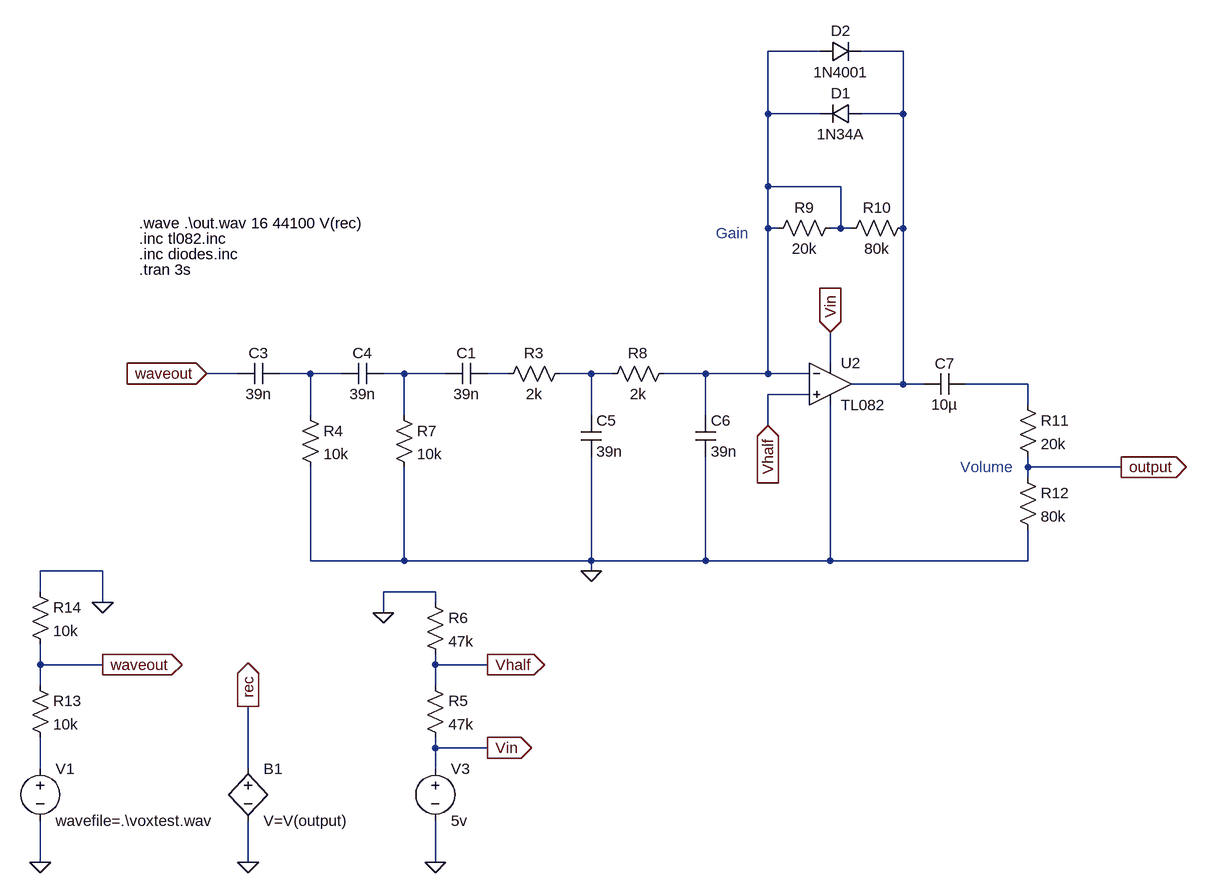
[diagram p0: schematic Telephoner2.asc]
Telephoner2.asc, the LTspice schematic file:
Version 4
SHEET 1 1324 692
WIRE -2720 -784 -2800 -784
WIRE -2592 -784 -2656 -784
WIRE -2800 -688 -2800 -784
WIRE -2720 -688 -2800 -688
WIRE -2592 -688 -2592 -784
WIRE -2592 -688 -2656 -688
WIRE -2800 -576 -2800 -688
WIRE -2688 -576 -2800 -576
WIRE -2800 -512 -2800 -576
WIRE -2784 -512 -2800 -512
WIRE -2688 -512 -2688 -576
WIRE -2688 -512 -2704 -512
WIRE -2672 -512 -2688 -512
WIRE -2592 -512 -2592 -688
WIRE -2704 -304 -2704 -352
WIRE -3616 -288 -3664 -288
WIRE -3504 -288 -3552 -288
WIRE -3456 -288 -3504 -288
WIRE -3360 -288 -3392 -288
WIRE -3296 -288 -3360 -288
WIRE -3200 -288 -3232 -288
WIRE -3072 -288 -3120 -288
WIRE -3040 -288 -3072 -288
WIRE -2896 -288 -2960 -288
WIRE -2800 -288 -2800 -512
WIRE -2800 -288 -2896 -288
WIRE -2736 -288 -2800 -288
WIRE -2592 -272 -2592 -512
WIRE -2592 -272 -2672 -272
WIRE -2560 -272 -2592 -272
WIRE -2400 -272 -2496 -272
WIRE -2736 -256 -2800 -256
WIRE -2400 -240 -2400 -272
WIRE -3504 -224 -3504 -288
WIRE -3360 -224 -3360 -288
WIRE -3072 -224 -3072 -288
WIRE -2896 -224 -2896 -288
WIRE -2800 -208 -2800 -256
WIRE -2400 -144 -2400 -160
WIRE -2256 -144 -2400 -144
WIRE -2400 -128 -2400 -144
WIRE -3504 0 -3504 -144
WIRE -3360 0 -3360 -144
WIRE -3360 0 -3504 0
WIRE -3072 0 -3072 -160
WIRE -3072 0 -3360 0
WIRE -2896 0 -2896 -160
WIRE -2896 0 -3072 0
WIRE -2704 0 -2704 -240
WIRE -2704 0 -2896 0
WIRE -2400 0 -2400 -48
WIRE -2400 0 -2704 0
WIRE -3824 16 -3920 16
WIRE -3072 16 -3072 0
WIRE -3920 48 -3920 16
WIRE -3312 48 -3392 48
WIRE -3824 64 -3824 16
WIRE -3312 64 -3312 48
WIRE -3392 80 -3392 48
WIRE -3920 160 -3920 128
WIRE -3824 160 -3920 160
WIRE -3312 160 -3312 144
WIRE -3232 160 -3312 160
WIRE -3920 192 -3920 160
WIRE -3312 192 -3312 160
WIRE -3312 288 -3312 272
WIRE -3232 288 -3312 288
WIRE -3920 320 -3920 272
WIRE -3600 320 -3600 224
WIRE -3312 320 -3312 288
WIRE -3920 464 -3920 400
WIRE -3600 464 -3600 400
WIRE -3312 464 -3312 400
FLAG -3920 464 0
FLAG -3824 160 waveout
IOPIN -3824 160 Out
FLAG -3664 -288 waveout
IOPIN -3664 -288 In
FLAG -3600 464 0
FLAG -3600 224 rec
IOPIN -3600 224 Out
FLAG -3312 464 0
FLAG -3232 288 Vin
IOPIN -3232 288 Out
FLAG -3392 80 0
FLAG -3232 160 Vhalf
IOPIN -3232 160 Out
FLAG -3072 16 0
FLAG -2800 -208 Vhalf
IOPIN -2800 -208 In
FLAG -2704 -352 Vin
IOPIN -2704 -352 In
FLAG -2256 -144 output
IOPIN -2256 -144 Out
FLAG -3824 64 0
SYMBOL voltage -3920 304 R0
SYMATTR InstName V1
SYMATTR Value wavefile=.\voxtest.wav
SYMBOL voltage -3312 304 R0
WINDOW 123 0 0 Left 2
WINDOW 39 0 0 Left 2
SYMATTR InstName V3
SYMATTR Value 5v
SYMBOL bv -3600 304 R0
SYMATTR InstName B1
SYMATTR Value V=V(output)
SYMBOL res -3328 176 R0
SYMATTR InstName R5
SYMATTR Value 47k
SYMBOL res -3328 48 R0
SYMATTR InstName R6
SYMATTR Value 47k
SYMBOL cap -3232 -304 R90
WINDOW 0 0 32 VBottom 2
WINDOW 3 32 32 VTop 2
SYMATTR InstName C1
SYMATTR Value 39n
SYMBOL cap -3552 -304 R90
WINDOW 0 0 32 VBottom 2
WINDOW 3 32 32 VTop 2
SYMATTR InstName C3
SYMATTR Value 39n
SYMBOL cap -3392 -304 R90
WINDOW 0 0 32 VBottom 2
WINDOW 3 32 32 VTop 2
SYMATTR InstName C4
SYMATTR Value 39n
SYMBOL res -3520 -240 R0
SYMATTR InstName R4
SYMATTR Value 10k
SYMBOL res -3376 -240 R0
SYMATTR InstName R7
SYMATTR Value 10k
SYMBOL res -3104 -304 R90
WINDOW 0 0 56 VBottom 2
WINDOW 3 32 56 VTop 2
SYMATTR InstName R3
SYMATTR Value 2k
SYMBOL res -2944 -304 R90
WINDOW 0 0 56 VBottom 2
WINDOW 3 32 56 VTop 2
SYMATTR InstName R8
SYMATTR Value 2k
SYMBOL cap -3088 -224 R0
SYMATTR InstName C5
SYMATTR Value 39n
SYMBOL cap -2912 -224 R0
SYMATTR InstName C6
SYMATTR Value 39n
SYMBOL Opamps\\opamp2 -2704 -336 R0
SYMATTR InstName U2
SYMATTR Value TL082
SYMBOL res -2688 -528 R90
WINDOW 0 0 56 VBottom 2
WINDOW 3 32 56 VTop 2
SYMATTR InstName R9
SYMATTR Value 20k
SYMBOL res -2576 -528 R90
WINDOW 0 0 56 VBottom 2
WINDOW 3 32 56 VTop 2
SYMATTR InstName R10
SYMATTR Value 80k
SYMBOL diode -2656 -704 R90
WINDOW 0 0 32 VBottom 2
WINDOW 3 32 32 VTop 2
SYMATTR InstName D1
SYMATTR Value 1N34A
SYMBOL diode -2720 -768 R270
WINDOW 0 32 32 VTop 2
WINDOW 3 0 32 VBottom 2
SYMATTR InstName D2
SYMATTR Value 1N4001
SYMBOL cap -2496 -288 R90
WINDOW 0 0 32 VBottom 2
WINDOW 3 32 32 VTop 2
SYMATTR InstName C7
SYMATTR Value 10µ
SYMBOL res -2416 -256 R0
SYMATTR InstName R11
SYMATTR Value 20k
SYMBOL res -2416 -144 R0
SYMATTR InstName R12
SYMATTR Value 80k
SYMBOL res -3936 176 R0
SYMATTR InstName R13
SYMATTR Value 10k
SYMBOL res -3936 32 R0
SYMATTR InstName R14
SYMATTR Value 10k
TEXT -3768 -520 Left 2 !.wave .\\out.wav 16 44100 V(rec)
TEXT -3768 -448 Left 2 !.tran 3s
TEXT -3768 -496 Left 2 !.inc tl082.inc
TEXT -3768 -472 Left 2 !.inc diodes.inc
TEXT -2880 -504 Left 2 ;Gain
TEXT -2504 -144 Left 2 ;Volume

The netlist it stands for:
* Telephoner2.asc
V1 N008 0 wavefile=.\voxtest.wav
V3 Vin 0 5v
B1 rec 0 V=V(output)
R5 Vhalf Vin 47k
R6 0 Vhalf 47k
C1 N005 N004 39n
C3 N003 waveout 39n
C4 N004 N003 39n
R4 N003 0 10k
R7 N004 0 10k
R3 N006 N005 2k
R8 N001 N006 2k
C5 N006 0 39n
C6 N001 0 39n
XU2 Vhalf N001 Vin 0 N002 TL082  ; pins In+ In- V+ V- OUT
R9 N001 N001 20k
R10 N002 N001 80k
D1 N002 N001 1N34A
D2 N001 N002 1N4001
C7 N007 N002 10µ
R11 N007 output 20k
R12 output 0 80k
R13 waveout N008 10k
R14 0 waveout 10k
.model D D
.lib standard.dio
.wave .\out.wav 16 44100 V(rec)
.tran 3s
.inc tl082.inc
.inc diodes.inc
* Gain
* Volume
.backanno
.end